# Altium project Driver.PrjPcb
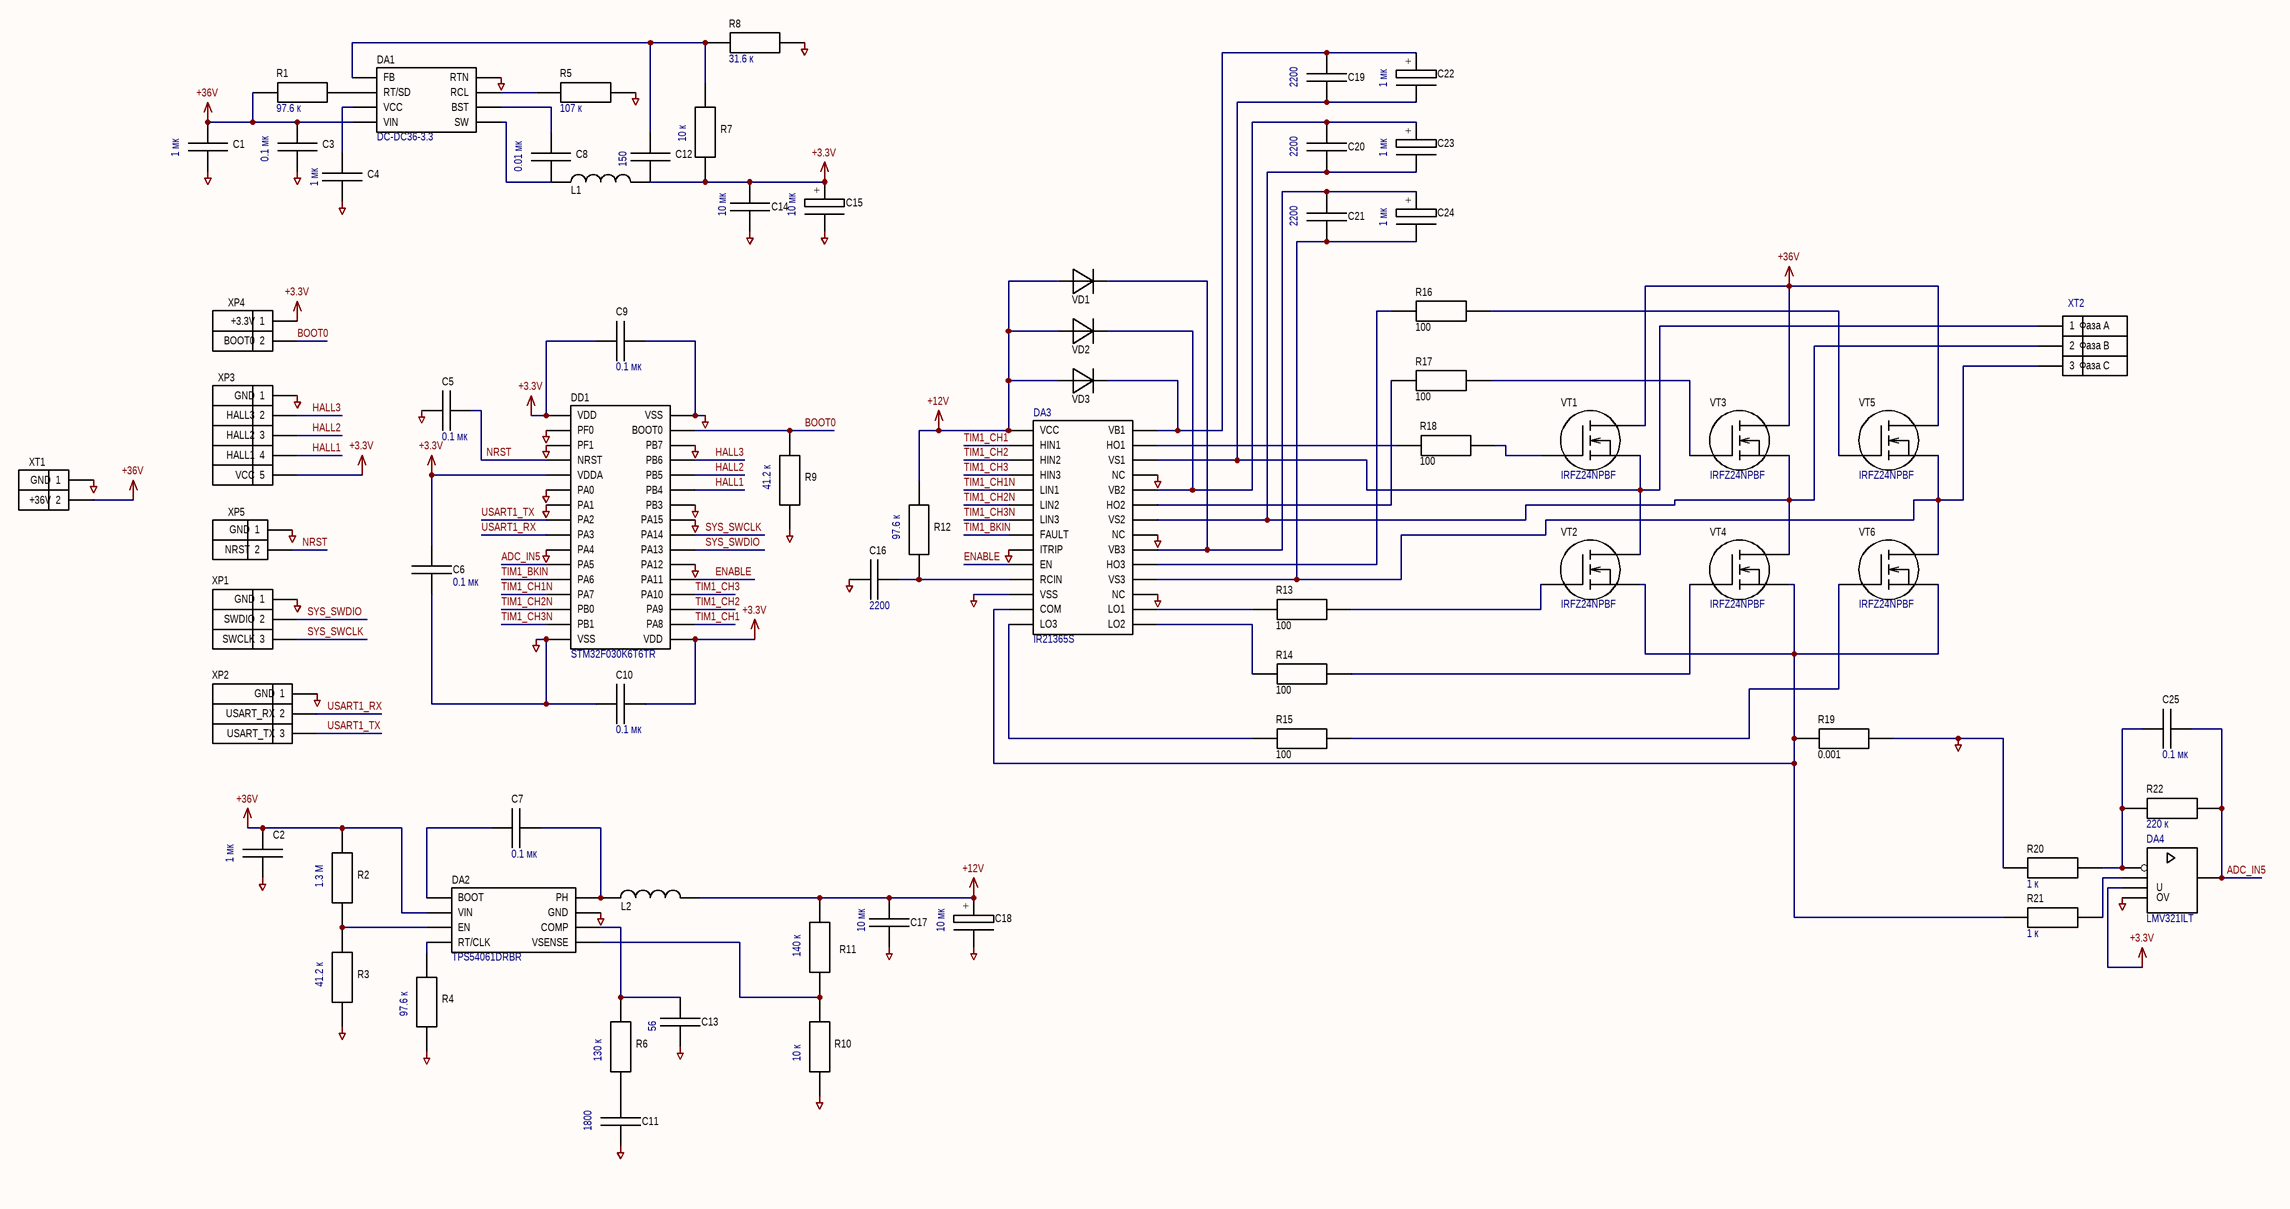
[diagram p0: Principial_scheme.SchDoc]
1 sheet, 70 parts. Net scope: global (net labels, ports and power ports of the same name join across sheets).
Board file: Driver.PcbDoc

## Sheet Principial_scheme.SchDoc
size A1

### Parts
DA1  DC-DC36-3.3  [VSSOP8]
DA2  TPS54061DRBR  [VSON8]
DA3  IR21365S  [SOIC28]
DA4  LMV321ILT  [SOT23-5]
DD1  STM32F030K6T6TR  [LQFP32]
L1  IND6X6  [IND6X6]  (value not drawn)
L2  IND3  [IND3]  (value not drawn)
R1  Resistance: 97.6 к  [RES0402]  (hidden comment: RES0402)
R2  Resistance: 1.3 М  [RES0402]  (hidden comment: RES0402)
R3  Resistance: 41.2 к  [RES0402]  (hidden comment: RES0402)
R4  Resistance: 97.6 к  [RES0402]  (hidden comment: RES0402)
R5  Resistance: 107 к  [RES0402]  (hidden comment: RES0402)
R6  Resistance: 130 к  [RES0402]  (hidden comment: RES0402)
R7  Resistance: 10 к  [RES0402]  (hidden comment: RES0402)
R8  Resistance: 31.6 к  [RES0402]  (hidden comment: RES0402)
R9  Resistance: 41.2 к  [RES0402]  (hidden comment: RES0402)
R10  Resistance: 10 к  [RES0402]  (hidden comment: RES0402)
R11  Resistance: 140 к  [RES0603]  (hidden comment: RES0603)
R12  Resistance: 97.6 к  [RES0402]  (hidden comment: RES0402)
R13  Resistance: 100  [RES2512]  (hidden comment: RES2512)
R14  Resistance: 100  [RES2512]  (hidden comment: RES2512)
R15  Resistance: 100  [RES2512]  (hidden comment: RES2512)
R16  Resistance: 100  [RES2512]  (hidden comment: RES2512)
R17  Resistance: 100  [RES2512]  (hidden comment: RES2512)
R18  Resistance: 100  [RES2512]  (hidden comment: RES2512)
R19  Resistance: 0.001  [RES2512]  (hidden comment: RES2512)
R20  Resistance: 1 к  [RES0402]  (hidden comment: RES0402)
R21  Resistance: 1 к  [RES0402]  (hidden comment: RES0402)
R22  Resistance: 220 к  [RES0402]  (hidden comment: RES0402)
VD1  DIODE  [SOD323]  (value not drawn)
VD2  DIODE  [SOD323]  (value not drawn)
VD3  DIODE  [SOD323]  (value not drawn)
VT1  IRFZ24NPBF  [TO-220]
VT2  IRFZ24NPBF  [TO-220]
VT3  IRFZ24NPBF  [TO-220]
VT4  IRFZ24NPBF  [TO-220]
VT5  IRFZ24NPBF  [TO-220]
VT6  IRFZ24NPBF  [TO-220]
XP1  SWDIO_CONNECTOR  [PLC-3]  (value not drawn)
XP2  UART_CONNECTOR  [PLC-3]  (value not drawn)
XP3  HALL_CONNECTOR  [PLC-5]  (value not drawn)
XP4  BOOT0_CONNECTOR  [PLC-2]  (value not drawn)
XP5  RESET_CONNECTOR  [PLC-2]  (value not drawn)
XT1  POWER_CONNECTOR  [350-2]  (value not drawn)
XT2  PHASE_CONNECTOR  [350-3]  (value not drawn)
С1  Capacitance: 1 мк  [CAP1206]  (hidden comment: CAP1206)
С2  Capacitance: 1 мк  [CAP1206]  (hidden comment: CAP1206)
С3  Capacitance: 0.1 мк  [CAP0805]  (hidden comment: CAP0805)
С4  Capacitance: 1 мк  [CAP0603]  (hidden comment: CAP0603)
С5  Capacitance: 0.1 мк  [CAP0603]  (hidden comment: CAP0603)
С6  Capacitance: 0.1 мк  [CAP0603]  (hidden comment: CAP0603)
С7  Capacitance: 0.1 мк  [CAP0402]  (hidden comment: CAP0402)
С8  Capacitance: 0.01 мк  [CAP0402]  (hidden comment: CAP0402)
С9  Capacitance: 0.1 мк  [CAP0603]  (hidden comment: CAP0603)
С10  Capacitance: 0.1 мк  [CAP0603]  (hidden comment: CAP0603)
С11  Capacitance: 1800  [CAP0603]  (hidden comment: CAP0603)
С12  Capacitance: 150  [CAP0402]  (hidden comment: CAP0402)
С13  Capacitance: 56  [CAP0805]  (hidden comment: CAP0805)
С14  Capacitance: 10 мк  [CAP0603]  (hidden comment: CAP0603)
С15  Capacitance: 10 мк  [CAPD4]  (hidden comment: CAPD4)
С16  Capacitance: 2200  [CAP0603]  (hidden comment: CAP0603)
С17  Capacitance: 10 мк  [CAP0603]  (hidden comment: CAP0603)
С18  Capacitance: 10 мк  [CAPD4]  (hidden comment: CAPD4)
С19  Capacitance: 2200  [CAP0603]  (hidden comment: CAP0603)
С20  Capacitance: 2200  [CAP0603]  (hidden comment: CAP0603)
С21  Capacitance: 2200  [CAP0603]  (hidden comment: CAP0603)
С22  Capacitance: 1 мк  [CAPD4]  (hidden comment: CAPD4)
С23  Capacitance: 1 мк  [CAPD4]  (hidden comment: CAPD4)
С24  Capacitance: 1 мк  [CAPD4]  (hidden comment: CAPD4)
С25  Capacitance: 0.1 мк  [CAP0805]  (hidden comment: CAP0805)

### Nets
+3.3V: DA4.2(U) DD1.1(VDD) DD1.5(VDDA) DD1.17(VDD) L1.2 R7.2 XP3.1(VCC__5) XP4.2(+3.3V__1) С6.2 С9.1 С10.2 С12.2 С14.1 С15.+
+12V: DA3.1(VCC) L2.2 R11.1 R12.1 VD1.1 VD2.1 VD3.1 С17.1 С18.+
+36V: DA1.8(VIN) DA2.2(VIN) R1.1 R2.1 VT1.D VT3.D VT5.D XT1.1(+36V__2) С1.1 С2.1 С3.1
GND: DA1.4(RTN) DA2.7(GND) DA2.9(THERMAL) DA3.9(ITRIP) DA3.12(VSS) DA3.17(NC) DA3.21(NC) DA3.25(NC) DA4.5(OV) DD1.2(PF0) DD1.3(PF1) DD1.6(PA0) DD1.7(PA1) DD1.10(PA4) DD1.16(VSS) DD1.22(PA12) DD1.25(PA15) DD1.26(PB3) DD1.30(PB7) DD1.32(VSS) R3.2 R4.2 R5.2 R8.2 R9.2 R10.2 R19.2 R20.1 XP1.3(GND__1) XP2.3(GND__1) XP3.5(GND__1) XP5.2(GND__1) XT1.2(GND__1) С1.2 С2.2 С3.2 С4.2 С5.1 С6.1 С9.2 С10.1 С11.2 С13.2 С14.2 С15.- С16.1 С17.2 С18.-
ADC_IN5: DA4.4 DD1.11(PA5) R22.2 С25.2
BOOT0: DD1.31(BOOT0) R9.1 XP4.1(BOOT0__2)
ENABLE: DA3.10(EN) DD1.21(PA11)
HALL1: DD1.27(PB4) XP3.2(HALL1__4)
HALL2: DD1.28(PB5) XP3.3(HALL2__3)
HALL3: DD1.29(PB6) XP3.4(HALL3__2)
NRST: DD1.4(NRST) XP5.1(NRST__2) С5.2
SYS_SWCLK: DD1.24(PA14) XP1.1(SWCLK__3)
SYS_SWDIO: DD1.23(PA13) XP1.2(SWDIO__2)
TIM1_BKIN: DA3.8(FAULT) DD1.12(PA6)
TIM1_CH1: DA3.2(HIN1) DD1.18(PA8)
TIM1_CH1N: DA3.5(LIN1) DD1.13(PA7)
TIM1_CH2: DA3.3(HIN2) DD1.19(PA9)
TIM1_CH2N: DA3.6(LIN2) DD1.14(PB0)
TIM1_CH3: DA3.4(HIN3) DD1.20(PA10)
TIM1_CH3N: DA3.7(LIN3) DD1.15(PB1)
USART1_RX: DD1.9(PA3) XP2.2(USART_RX__2)
USART1_TX: DD1.8(PA2) XP2.1(USART_TX__3)
NetDA1_1: DA1.1(SW) L1.1 С8.2
NetDA1_2: DA1.2(BST) С8.1
NetDA1_3: DA1.3(RCL) R5.1
NetDA1_5: DA1.5(FB) R7.1 R8.1 С12.1
NetDA1_6: DA1.6(RT/SD) R1.2
NetDA1_7: DA1.7(VCC) С4.1
NetDA2_1: DA2.1(BOOT) С7.1
NetDA2_3: DA2.3(EN) R2.2 R3.1
NetDA2_4: DA2.4(RT/CLK) R4.1
NetDA2_5: DA2.5(VSENSE) R10.1 R11.2
NetDA2_6: DA2.6(COMP) R6.1 С13.1
NetDA2_8: DA2.8(PH) L2.1 С7.2
NetDA3_11: DA3.11(RCIN) R12.2 С16.2
NetDA3_13: DA3.13(COM) R19.1 R21.1 VT2.S VT4.S VT6.S
NetDA3_14: DA3.14(LO3) R15.1
NetDA3_15: DA3.15(LO2) R14.1
NetDA3_16: DA3.16(LO1) R13.1
NetDA3_18: DA3.18(VS3) VT5.S VT6.D XT2.3(3__Фаза_C) С21.2 С24.-
NetDA3_19: DA3.19(HO3) R16.1
NetDA3_20: DA3.20(VB3) VD1.2 С21.1 С24.+
NetDA3_22: DA3.22(VS2) VT3.S VT4.D XT2.2(2__Фаза_B) С20.2 С23.-
NetDA3_23: DA3.23(HO2) R17.1
NetDA3_24: DA3.24(VB2) VD2.2 С20.1 С23.+
NetDA3_26: DA3.26(VS1) VT1.S VT2.D XT2.1(1__Фаза_А) С19.2 С22.-
NetDA3_27: DA3.27(HO1) R18.1
NetDA3_28: DA3.28(VB1) VD3.2 С19.1 С22.+
NetDA4_1: DA4.1 R21.2
NetDA4_3: DA4.3 R20.2 R22.1 С25.1
NetR6_2: R6.2 С11.1
NetR13_2: R13.2 VT2.G
NetR14_2: R14.2 VT4.G
NetR15_2: R15.2 VT6.G
NetR16_2: R16.2 VT5.G
NetR17_2: R17.2 VT3.G
NetR18_2: R18.2 VT1.G

### Library data of the parts
DA1 = DC-DC36-3.3: LM5008MM/NOPB
DA2 = DC-DC36-12
DA3 = DRIVER
DA4 = OPAMP
DD1 = MCU
VT1-VT6 = MOSFET